# EAGLE design smart_irrigation (EAGLE 7.5.0)
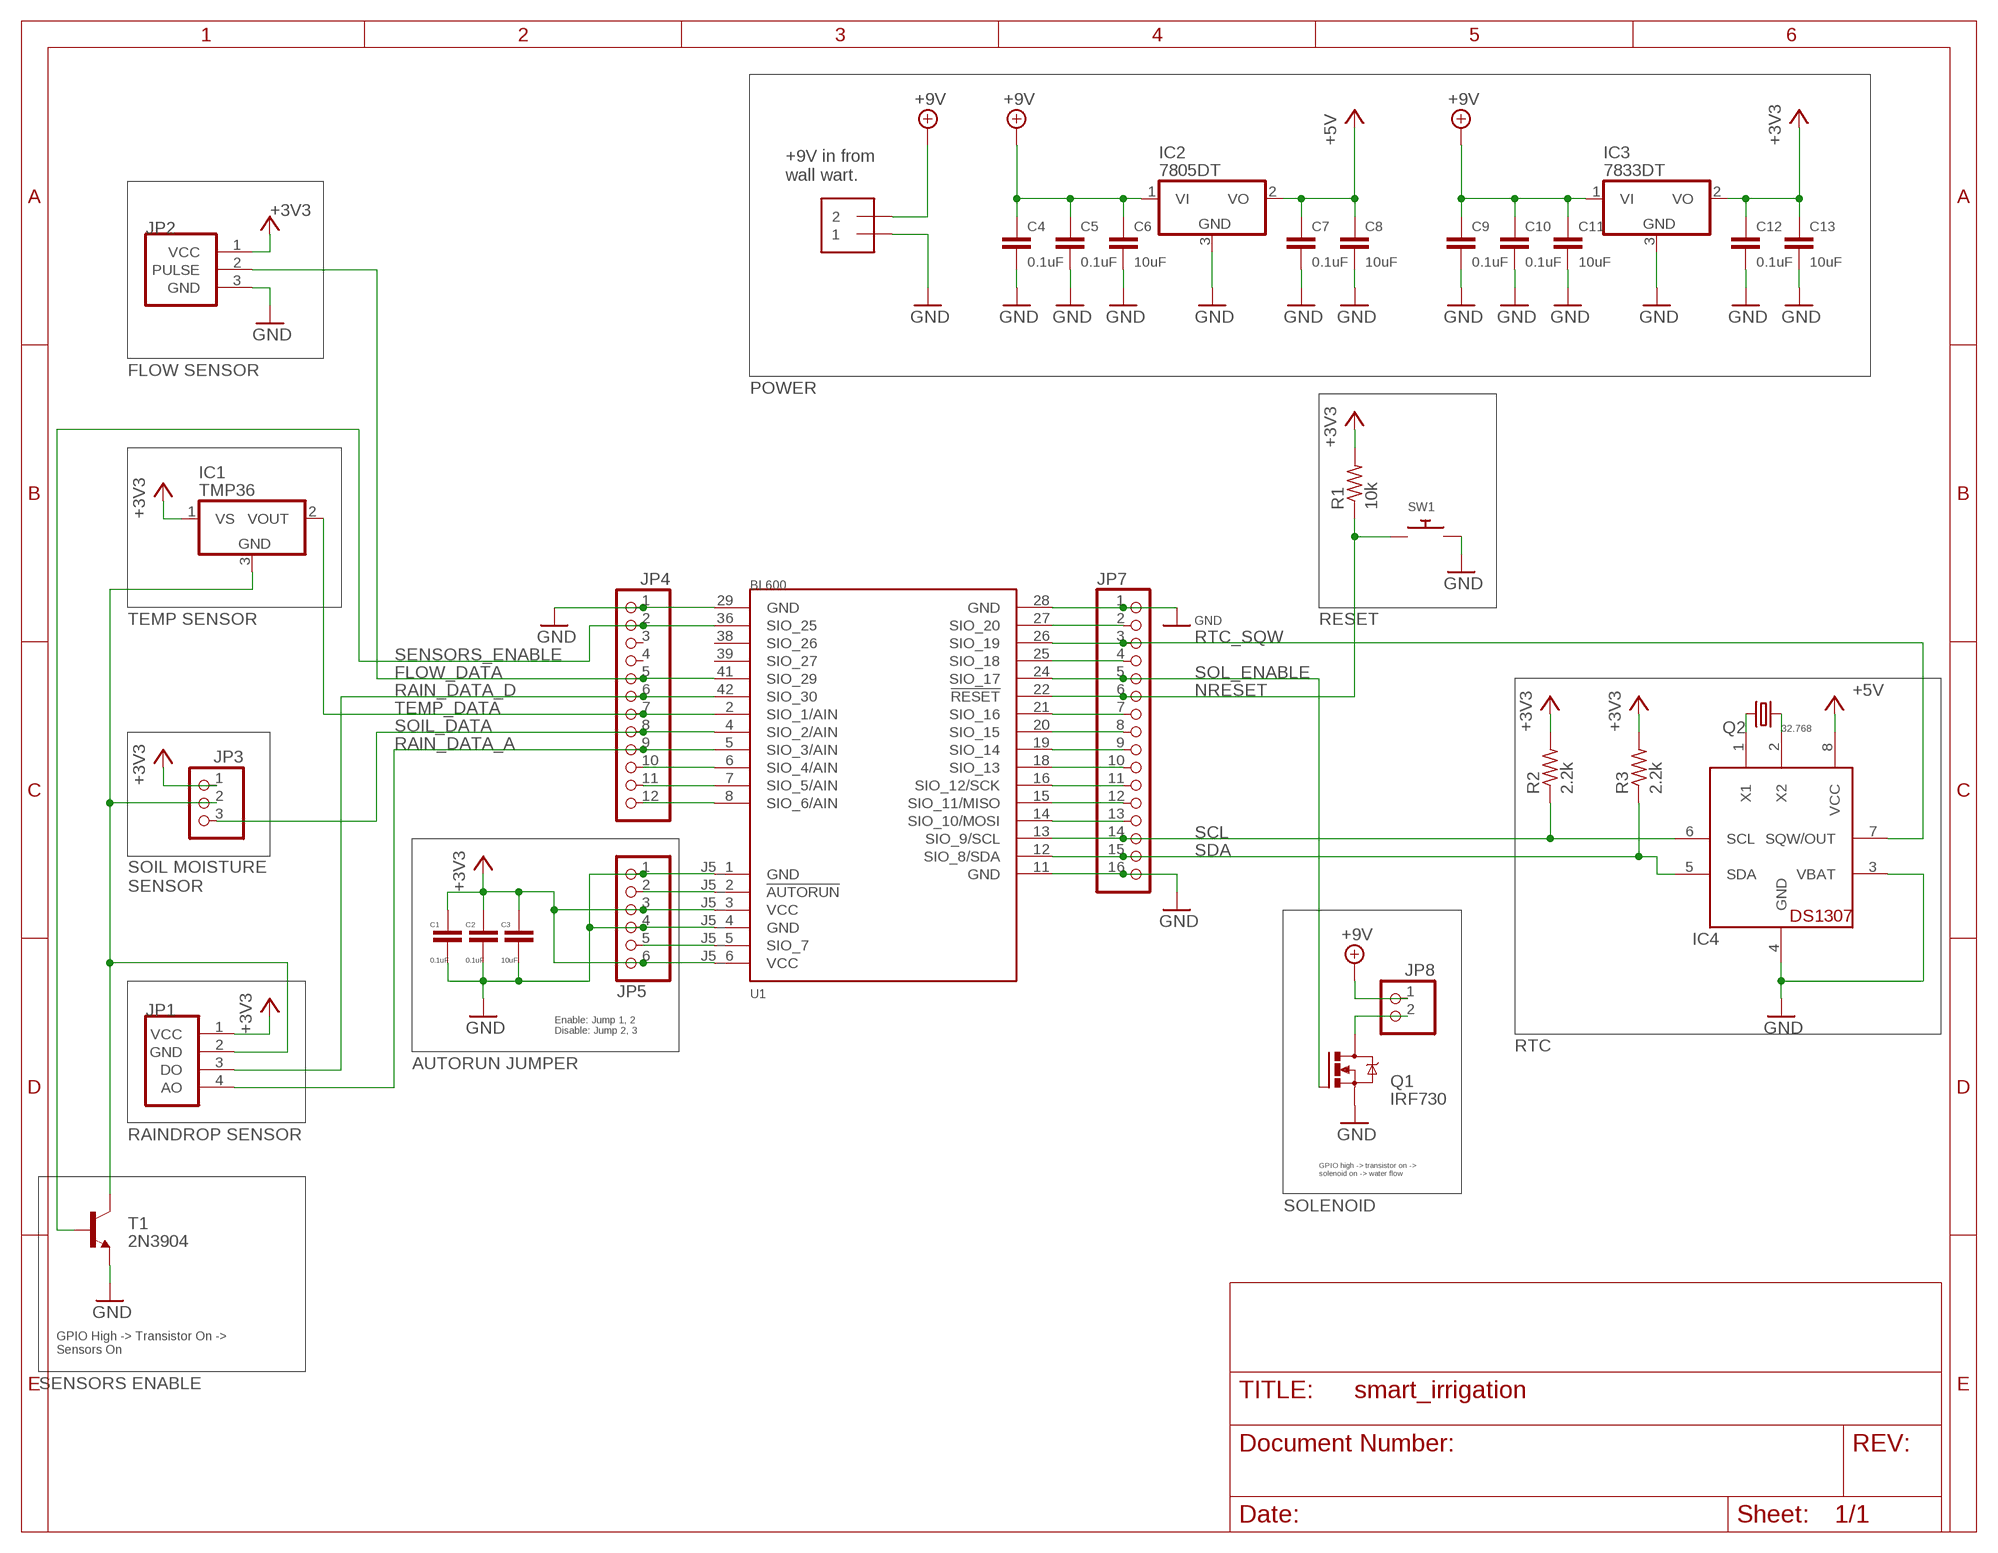
[diagram p0: schematic, sheet 1]

## Parts
C1  0.1uF  C-EUC0805  [C0805]
C2  0.1uF  C-EUC0805  [C0805]
C3  10uF  C-EUC0805  [C0805]
C4  0.1uF  C-EUC0805  [C0805]
C5  0.1uF  C-EUC0805  [C0805]
C6  10uF  C-EUC0805  [C0805]
C7  0.1uF  C-EUC0805  [C0805]
C8  10uF  C-EUC0805  [C0805]
C9  0.1uF  C-EUC0805  [C0805]
C10  0.1uF  C-EUC0805  [C0805]
C11  10uF  C-EUC0805  [C0805]
C12  0.1uF  C-EUC0805  [C0805]
C13  10uF  C-EUC0805  [C0805]
IC1  TMP36  [TO92]
IC2  7805DT  [TO252]
IC3  7833DT  [TO252]
IC4  DS1307  [DIL08]
JP1  RAINDROP  [1X04]
JP2  FLOW  [1X03]
JP3  PINHD-1X3  [1X03]
JP4  PINHD-1X12  [1X12]
JP5  PINHD-1X6  [1X06]
JP6  1X2-3.5MM  [1X2-3.5MM]
JP7  PINHD-1X16  [1X16]
JP8  PINHD-1X2  [1X02]
Q1  IRF730  [TO220]
Q2  32.768  CRYSTALTC38H  [TC38H]
R1  10k  R-US_M0805  [M0805]
R2  2.2k  R-US_M0805  [M0805]
R3  2.2k  R-US_M0805  [M0805]
SW1  SWITCH_PUSHBUTTONEVQ-PE  [TACT_PANA-EVQ]
T1  2N3904  [TO92]
U1  BL600  [BOB]

## Nets
3V3_TRAN_COL: IC1.3(GND) JP1.2(GND) JP3.2 T1.1(C)
+3V3: C1.1 C2.1 C3.1 C12.1 C13.1 IC1.1(VS) IC3.2(VO) JP1.1(VCC) JP2.1(VCC) JP3.1 JP5.3 JP5.6 R1.2 R2.2 R3.2 U1.J5_3(VCC) U1.J5_6(VCC)
+5V: C7.1 C8.1 IC2.2(VO) IC4.8(VCC)
+9V: C4.1 C5.1 C6.1 C9.1 C10.1 C11.1 IC2.1(VI) IC3.1(VI) JP6.2 JP8.1
FLOW_DATA: JP2.2(PULSE) JP4.5 U1.41(SIO_29)
GND: C1.2 C2.2 C3.2 C4.2 C5.2 C6.2 C7.2 C8.2 C9.2 C10.2 C11.2 C12.2 C13.2 IC2.3(GND) IC3.3(GND) IC4.3(VBAT) IC4.4(GND) JP2.3(GND) JP4.1 JP5.1 JP5.4 JP6.1 JP7.1 JP7.16 Q1.S SW1.P$2 T1.3(E) U1.11(GND) U1.28(GND) U1.29(GND) U1.J5_1(GND) U1.J5_4(GND)
N$1: IC4.1(X1) Q2.2
N$3: IC4.2(X2) Q2.1
NAUTORUN: JP5.2 U1.J5_2(!AUTORUN)
NRESET: JP7.6 R1.1 SW1.P$1 U1.22(!RESET)
RAIN_DATA_A: JP1.4(AO) JP4.9 U1.5(SIO_3/AIN)
RAIN_DATA_D: JP1.3(DO) JP4.6 U1.42(SIO_30)
RTC_SQW: IC4.7(SQW/OUT) JP7.3 U1.26(SIO_19)
SCL: IC4.6(SCL) JP7.14 R2.1 U1.13(SIO_9/SCL)
SDA: IC4.5(SDA) JP7.15 R3.1 U1.12(SIO_8/SDA)
SENSORS_ENABLE: JP4.2 T1.2(B) U1.36(SIO_25)
SIO_4: JP4.10 U1.6(SIO_4/AIN)
SIO_5: JP4.11 U1.7(SIO_5/AIN)
SIO_6: JP4.12 U1.8(SIO_6/AIN)
SIO_7: JP5.5 U1.J5_5(SIO_7)
SIO_10/MOSI: JP7.13 U1.14(SIO_10/MOSI)
SIO_11/MISO: JP7.12 U1.15(SIO_11/MISO)
SIO_12/SCK: JP7.11 U1.16(SIO_12/SCK)
SIO_13: JP7.10 U1.18(SIO_13)
SIO_14: JP7.9 U1.19(SIO_14)
SIO_15: JP7.8 U1.20(SIO_15)
SIO_16: JP7.7 U1.21(SIO_16)
SIO_18: JP7.4 U1.25(SIO_18)
SIO_20: JP7.2 U1.27(SIO_20)
SOIL_DATA: JP3.3 JP4.8 U1.4(SIO_2/AIN)
SOL_DRAIN: JP8.2 Q1.D
SOL_ENABLE: JP7.5 Q1.G U1.24(SIO_17)
TEMP_DATA: IC1.2(VOUT) JP4.7 U1.2(SIO_1/AIN)
Unconnected: JP4.3 JP4.4 U1.38(SIO_26) U1.39(SIO_27)

## Notes on the sheet
- +9V in from
  wall wart.
- FLOW SENSOR
- POWER
- TEMP SENSOR | RESET
- SOIL MOISTURE
  SENSOR
- Enable: Jump 1, 2
  Disable: Jump 2, 3
- RTC
- AUTORUN JUMPER
- RAINDROP SENSOR
- GPIO high -> transistor on ->
  solenoid on -> water flow
- SOLENOID
- GPIO High -> Transistor On ->
  Sensors On
- SENSORS ENABLE

## Library data of the parts
C1-C13 = rcl:C-EU: CAPACITOR, European symbol
IC1 = smart_irrigation:TMP36
IC2 = linear:78*: Positive VOLTAGE REGULATOR Source: http://cache.national.com/ds/LM/LM78L05.pdf http://www.fairchildsemi.com/ds/LM/LM7805.pdf
IC3 = smart_irrigation:78: Positive VOLTAGE REGULATOR Source: http://cache.national.com/ds/LM/LM78L05.pdf http://www.fairchildsemi.com/ds/LM/LM7805.pdf
IC4 = adafruit:DS1307: DS1307 Real time clock (RTC) with battery backup ability. Talk to it via i2c
JP1 = smart_irrigation:RAINDROP
JP2 = smart_irrigation:FLOW: PIN HEADER
JP3 = pinhead:PINHD-1X3: PIN HEADER
JP4 = pinhead:PINHD-1X12: PIN HEADER
JP5 = pinhead:PINHD-1X6: PIN HEADER
JP6 = adafruit:1X2: 3.5mm Terminal block http://www.ladyada.net/library/pcb/eaglelibrary.html
JP7 = pinhead:PINHD-1X16: PIN HEADER
JP8 = pinhead:PINHD-1X2: PIN HEADER
Q1 = smart_irrigation:IRF730: N-CHANNEL MOS FET
Q2 = crystal:CRYSTAL: CRYSTAL; OC_FARNELL: unknown; OC_NEWARK: unknown
R1-R3 = rcl:R-US_: RESISTOR, American symbol
SW1 = adafruit:SWITCH_PUSHBUTTON: Buttons SOFTTOUCHSMD_SJ - Soft touch temporary push button (Super Junk Akihabara) Compatible with SKPMANE010 [Mouser: 688-SKPMAN] C&K_KSS = Digikey: KSS221GLFS
T1 = transistor:2N3904: NPN TRANSISTOR
U1 = smart_irrigation:BL600

## Board
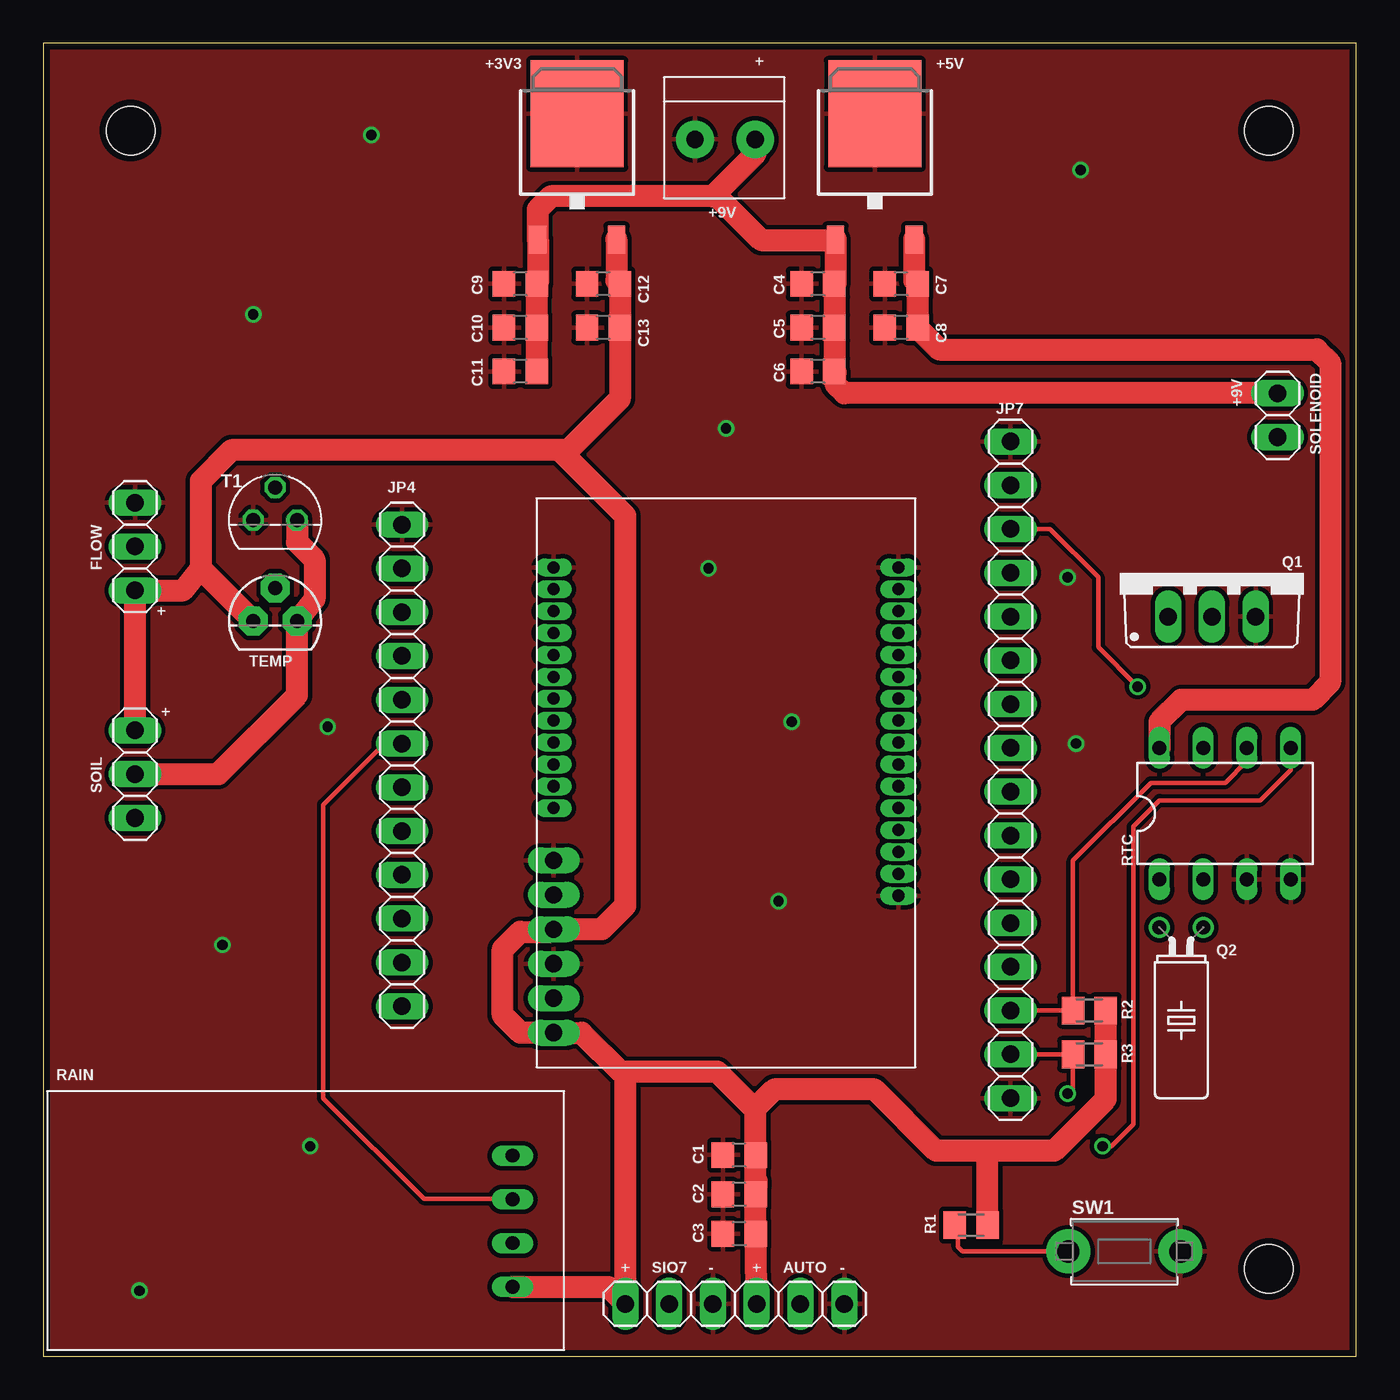
[diagram p1: board, top side]
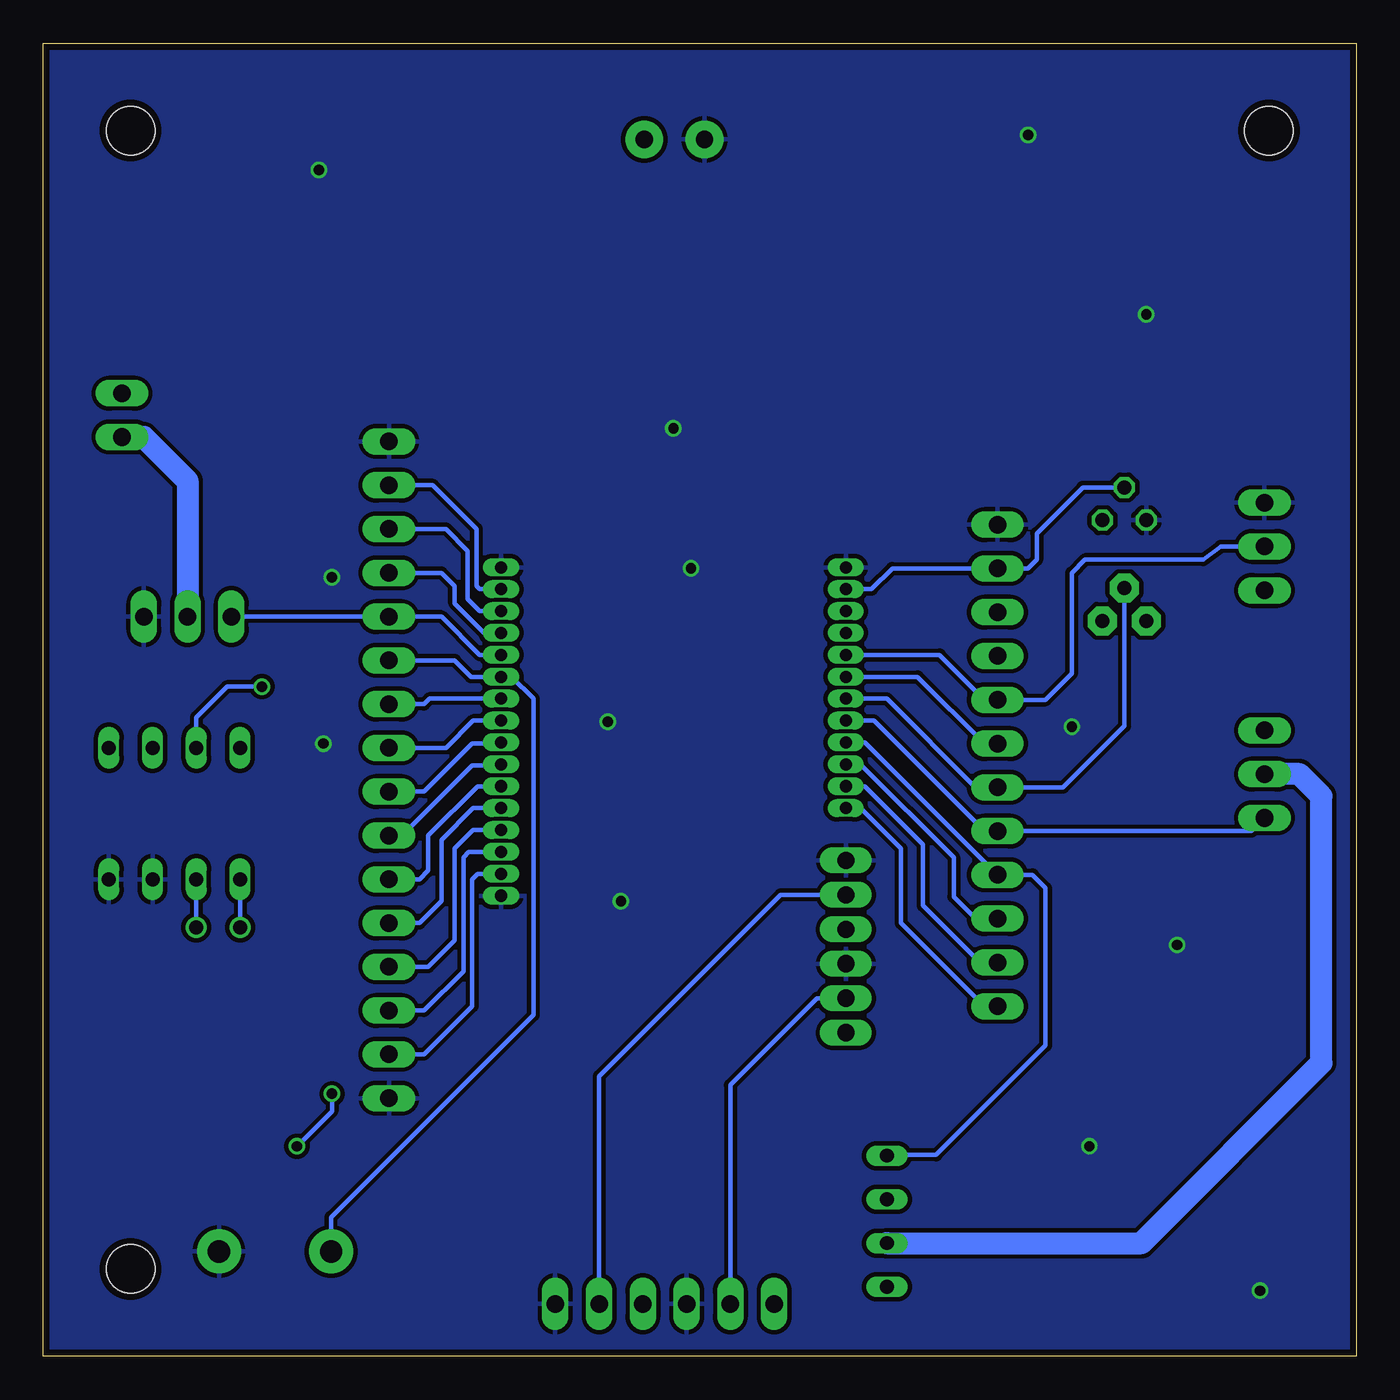
[diagram p2: board, bottom side, seen from below]

Size 76.2 x 76.2 mm. Coordinates in mm from the lower left corner, seen from the top.
Outline: 0,0 76.2,0 76.2,76.2 0,76.19 0,0
Copper layers (1*16): Top 0.0356mm / dielectric 1.5011mm / Bottom 0.0356mm
Design rules "LaenPCBOrder": minimum track width 6mil, minimum drill 13mil, track to track 6mil, track to pad 6mil, pad to pad 6mil, via to via 6mil, smd to smd 6mil, copper to edge 15mil, drill to drill 6mil, minimum pad ring 7mil, minimum via ring 7mil, stop-mask expansion 3mil, vias tented up to drill 0mil, thermal gap 10mil
Holes 2.8 mm at 5.08,71.12 71.12,5.08 71.12,71.12

### Footprints (pad centres in the part's own frame; a part is rotated, then mirrored left to right if it is on the bottom)
C0805 = smd 1.3 x 1.5: 1 -0.95,0; 2 0.95,0
TO92 = drill 0.813 pad 1.676 octagon: 1 -1.27,0; 2 0,1.905; 3 1.27,0
TO252 = smd 1 x 1.6: 1 -2.28,-4.8; 2 2.28,-4.8 | smd 5.4 x 6.2: 3 0,2.5
DIL08 = drill 0.813 long: 1 -3.81,-3.81; 2 -1.27,-3.81; 3 1.27,-3.81; 4 3.81,-3.81; 5 3.81,3.81; 6 1.27,3.81; 7 -1.27,3.81; 8 -3.81,3.81
1X04 = drill 0.8 long: 1 -12,4.35; 2 -12,1.81; 3 -12,-0.73; 4 -12,-3.27
1X03 = drill 1.016 long: 1 -2.54,0; 2 0,0; 3 2.54,0
1X12 = drill 1.016 long: 1 -13.97,0; 2 -11.43,0; 3 -8.89,0; 4 -6.35,0; 5 -3.81,0; 6 -1.27,0; 7 1.27,0; 8 3.81,0; 9 6.35,0; 10 8.89,0; 11 11.43,0; 12 13.97,0
1X06 = drill 1.016 long: 1 -6.35,0; 2 -3.81,0; 3 -1.27,0; 4 1.27,0; 5 3.81,0; 6 6.35,0
1X2-3.5MM = drill 1 pad 2.184: 1 1.8,0; 2 -1.7,0
1X16 = drill 1.016 long: 1 -19.05,0; 2 -16.51,0; 3 -13.97,0; 4 -11.43,0; 5 -8.89,0; 6 -6.35,0; 7 -3.81,0; 8 -1.27,0; 9 1.27,0; 10 3.81,0; 11 6.35,0; 12 8.89,0; 13 11.43,0; 14 13.97,0; 15 16.51,0; 16 19.05,0
1X02 = drill 1.016 long: 1 -1.27,0; 2 1.27,0
TO220 = drill 1.016 long: D 0,-2.54; G -2.54,-2.54; S 2.54,-2.54
TC38H = drill 0.813: 1 -1.27,0; 2 1.27,0
M0805 = smd 1.3 x 1.6: 1 -0.95,0; 2 0.95,0
TACT_PANA-EVQ = drill 1.3 pad 2.54: P$1 -3.25,0; P$2 3.25,0
TO92' = drill 0.813 octagon: 1 1.27,0; 2 0,1.905; 3 -1.27,0
BOB = drill 0.7 long: 2 -10,4.38; 4 -10,3.11; 5 -10,1.84; 6 -10,0.57; 7 -10,-0.7; 8 -10,-1.97; 11 10,-7.05; 12 10,-5.78; 13 10,-4.51; 14 10,-3.24; 15 10,-1.97; 16 10,-0.7; 18 10,0.57; 19 10,1.84; 20 10,3.11; 21 10,4.38; 22 10,5.65; 24 10,6.92; 25 10,8.19; 26 10,9.46; 27 10,10.73; 28 10,12; 29 -10,12; 36 -10,10.73; 38 -10,9.46; 39 -10,8.19; 41 -10,6.92; 42 -10,5.65 | drill 1 long: J5_1 -10,-5; J5_2 -10,-7; J5_3 -10,-9; J5_4 -10,-11; J5_5 -10,-13; J5_6 -10,-15

### Placement (x,y rotation side)
C1  40.39,11.68 180 top
C2  40.39,9.4 180 top
C3  40.39,7.11 180 top
C4  44.96,62.23 180 top
C5  44.96,59.69 180 top
C6  44.96,57.15 180 top
C7  49.78,62.23 180 top
C8  49.78,59.69 180 top
C9  27.69,62.23 180 top
C10  27.69,59.69 180 top
C11  27.69,57.15 180 top
C12  32.51,62.23 180 top
C13  32.51,59.69 180 top
IC1  13.46,42.67 0 top
IC2  48.26,69.6 0 top
IC3  30.99,69.6 0 top
IC4  68.58,31.5 0 top
JP1  15.24,8.38 180 top
JP2  5.33,46.99 90 top
JP3  5.33,33.78 270 top
JP4  20.83,34.29 270 top
JP5  40.13,3.05 180 top
JP6  39.62,70.61 180 top
JP7  56.13,34.04 270 top
JP8  71.63,54.61 270 top
Q1  67.82,45.47 0 top
Q2  66.04,24.89 180 top
R1  53.85,7.62 0 top
R2  60.71,20.07 0 top
R3  60.71,17.53 0 top
SW1  62.74,6.1 0 top
T1  2N3904  [TO92']  13.46,48.51 0 top
U1  39.62,33.78 0 top

### Tracks (layer width: path | path; a pad name or v marks a point on that pad's centre or on a via)
3V3_TRAN_COL
  Top 1.27: JP3.2 10.16,33.78 14.73,38.35 IC1.3 15.75,43.94 15.75,46.23 14.73,47.24 T1.1
  Bottom 1.27: JP1.2 12.48,6.57 2.03,17.02 2.03,32.51 3.3,33.78 JP3.2
+3V3
  Top 1.27: IC3.2 33.27,62.42 C12.1 C13.1 33.46,55.56 30.48,52.58 29.97,52.58 | 54.86,11.94 58.67,11.94 61.66,14.92 R3.2 R2.2 | 54.86,11.94 51.82,11.94 48.26,15.49 42.42,15.49 41.34,14.41 | 29.97,52.58 10.92,52.58 9.14,50.8 9.14,45.72 | 9.14,45.72 IC1.1 | 29.97,52.58 33.78,48.77 33.78,26.16 32.4,24.78 U1.J5_3 29.48,24.64 27.69,24.64 26.67,23.62 26.67,19.81 27.69,18.8 29.61,18.8 U1.J5_6 31.26,18.78 33.53,16.51 33.78,16.51 | JP3.1 JP2.1 8.13,44.45 9.14,45.72 | R1.2 54.8,11.87 54.86,11.94 | 41.4,9.91 41.4,10.16 C2.1 | C2.1 C3.1 41.34,5.4 JP5.3 | C2.1 C1.1 41.34,14.41 | 41.34,14.41 41.21,14.41 39.12,16.51 33.78,16.51 | JP1.1 32.8,4.03 JP5.6 33.78,16.51
  Bottom 1.27: 29.84,24.89 U1.J5_3 | 29.61,18.8 U1.J5_6 29.64,18.8
+5V
  Top 1.27: IC2.2 50.54,62.42 C7.1 C8.1 52,58.42 73.91,58.42 74.68,57.66 74.68,39.12 73.66,38.1 66.04,38.1 64.77,36.83 IC4.8
+9V
  Top 1.27: 28.68,62.28 C9.1 | C9.1 C10.1 C11.1 | C9.1 28.71,62.3 IC3.1 28.7,66.55 29.46,67.31 38.86,67.31 38.99,67.44 | JP8.1 46.48,55.88 45.97,56.39 45.97,57.08 C6.1 C5.1 C4.1 45.97,62.3 IC2.1 45.95,64.77 41.66,64.77 38.99,67.44 | JP6.2 41.32,69.77 38.99,67.44
FLOW_DATA
  Bottom 0.254: JP2.2 7.87,46.99 8.89,46.23 15.75,46.23 16.51,45.47 16.51,39.62 18.03,38.1 JP4.5 21.59,38.1 24.19,40.7 U1.41
GND  (via drill 0.6)
  other vias: 42.67,26.42 43.43,36.83 12.19,60.45 19.05,70.87 39.62,53.85 60.2,68.83 10.41,23.88 5.59,3.81 15.49,12.19 38.61,45.72 59.94,35.56 59.44,45.21 16.51,36.53
  pour Top (isolate 0.254): 0,76.2 76.2,76.2 76.2,0 0,0
  pour Bottom (isolate 0.254): 0,76.2 76.2,75.95 76.2,-0.25 0,0
N$1
  Bottom 0.254: IC4.1 Q2.2
N$3
  Bottom 0.254: IC4.2 Q2.1
NAUTORUN
  Bottom 0.254: JP5.2 43.94,16.26 33.42,26.78 U1.J5_2
NRESET
  Top 0.254: SW1.P$1 53.34,6.1 53.09,6.35 53.09,7.43 R1.1
  Bottom 0.254: SW1.P$1 59.49,8.08 47.75,19.81 47.75,38.16 49.02,39.43 U1.22 51.37,39.43 52.32,40.39 JP7.6
RAIN_DATA_A
  Bottom 0.254: JP1.4 27.21,11.68 24.38,11.68 18.03,18.03 18.03,27.18 18.8,27.94 JP4.9 28.51,35.62 U1.5
RAIN_DATA_D
  Top 0.254: JP4.6 19.81,35.56 16.26,32 16.26,14.99 22.1,9.14 27.21,9.14 JP1.3
  Bottom 0.254: U1.42 25.46,39.43 21.59,35.56 JP4.6
RTC_SQW  (via drill 0.6)
  Top 0.254: JP7.3 58.42,48.01 61.21,45.21 61.21,41.15 v63.5,38.86
  Bottom 0.254: U1.26 50.86,43.24 51.56,43.94 51.56,46.74 52.83,48.01 JP7.3 | v63.5,38.86 65.53,38.86 67.31,37.08 IC4.7
SCL
  Top 0.254: 69.85,35.46 IC4.6 69.85,34.54 68.58,33.27 64.26,33.27 59.76,28.77 R2.1 JP7.14
  Bottom 0.254: U1.13 51.5,29.27 51.82,28.96 51.82,22.35 54.1,20.07 JP7.14
SDA  (via drill 0.6)
  Top 0.254: JP7.15 R3.1 59.76,15.56 v59.44,15.24 | v61.47,12.19 61.98,12.19 63.25,13.46 63.25,30.73 64.77,32.26 70.61,32.26 72.39,34.04 IC4.5
  Bottom 0.254: U1.12 50.99,28 51.31,27.69 51.31,20.32 54.1,17.53 JP7.15 | v59.44,15.24 59.44,14.22 v61.47,12.19
SENSORS_ENABLE
  Bottom 0.254: T1.2 15.88,50.42 18.54,47.75 18.54,46.23 19.05,45.72 JP4.2 26.92,45.72 28.13,44.51 U1.36
SIO_4
  Bottom 0.254: U1.6 28.76,34.35 23.37,28.96 23.37,26.67 22.1,25.4 JP4.10
SIO_5
  Bottom 0.254: U1.7 28.51,33.08 25.15,29.72 25.15,26.16 21.84,22.86 JP4.11
SIO_6
  Bottom 0.254: U1.8 28.76,31.81 26.42,29.46 26.42,25.15 21.59,20.32 JP4.12
SIO_7
  Bottom 0.254: JP5.5 36.32,15.75 31.29,20.78 U1.J5_5
SIO_10/MOSI
  Bottom 0.254: U1.14 51.25,30.54 52.32,29.46 52.32,24.13 53.85,22.61 JP7.13
SIO_11/MISO
  Bottom 0.254: U1.15 51.25,31.81 53.09,29.97 53.09,26.42 54.36,25.15 JP7.12
SIO_12/SCK
  Bottom 0.254: U1.16 50.99,33.08 53.85,30.23 53.85,28.19 54.36,27.69 JP7.11
SIO_13
  Bottom 0.254: U1.18 49.69,34.29 51.31,34.29 55.37,30.23 JP7.10
SIO_14
  Bottom 0.254: U1.19 49.69,35.56 51.31,35.56 54.1,32.77 JP7.9
SIO_15
  Bottom 0.254: U1.20 51.25,36.89 52.83,35.31 JP7.8
SIO_16
  Bottom 0.254: U1.21 53.79,38.16 54.1,37.85 JP7.7
SIO_18
  Bottom 0.254: U1.25 50.61,41.97 52.32,43.69 52.32,44.7 53.09,45.47 JP7.4
SIO_20
  Bottom 0.254: U1.27 50.86,44.51 51.05,44.7 51.05,48.01 53.59,50.55 JP7.2
SOIL_DATA
  Bottom 0.254: U1.4 28,36.89 21.59,30.48 JP4.8 6.1,30.48 JP3.3
SOL_DRAIN
  Bottom 1.27: Q1.D 67.82,50.8 70.36,53.34 JP8.2
SOL_ENABLE
  Bottom 0.254: Q1.G JP7.5 53.09,42.93 50.86,40.7 U1.24
TEMP_DATA
  Bottom 0.254: IC1.2 13.46,36.58 17.02,33.02 JP4.7 22.1,33.02 27.24,38.16 U1.2

### Text on the board
tNames: +3V3 | + | +5V | +9V | +9V | SOLENOID | FLOW | + | TEMP | + | SOIL | RTC | RAIN | + | SIO7 | - | + | AUTO | -